# EAGLE schematic SparkFun_Qwiic_Audio_Amp (EAGLE 9.6.2)
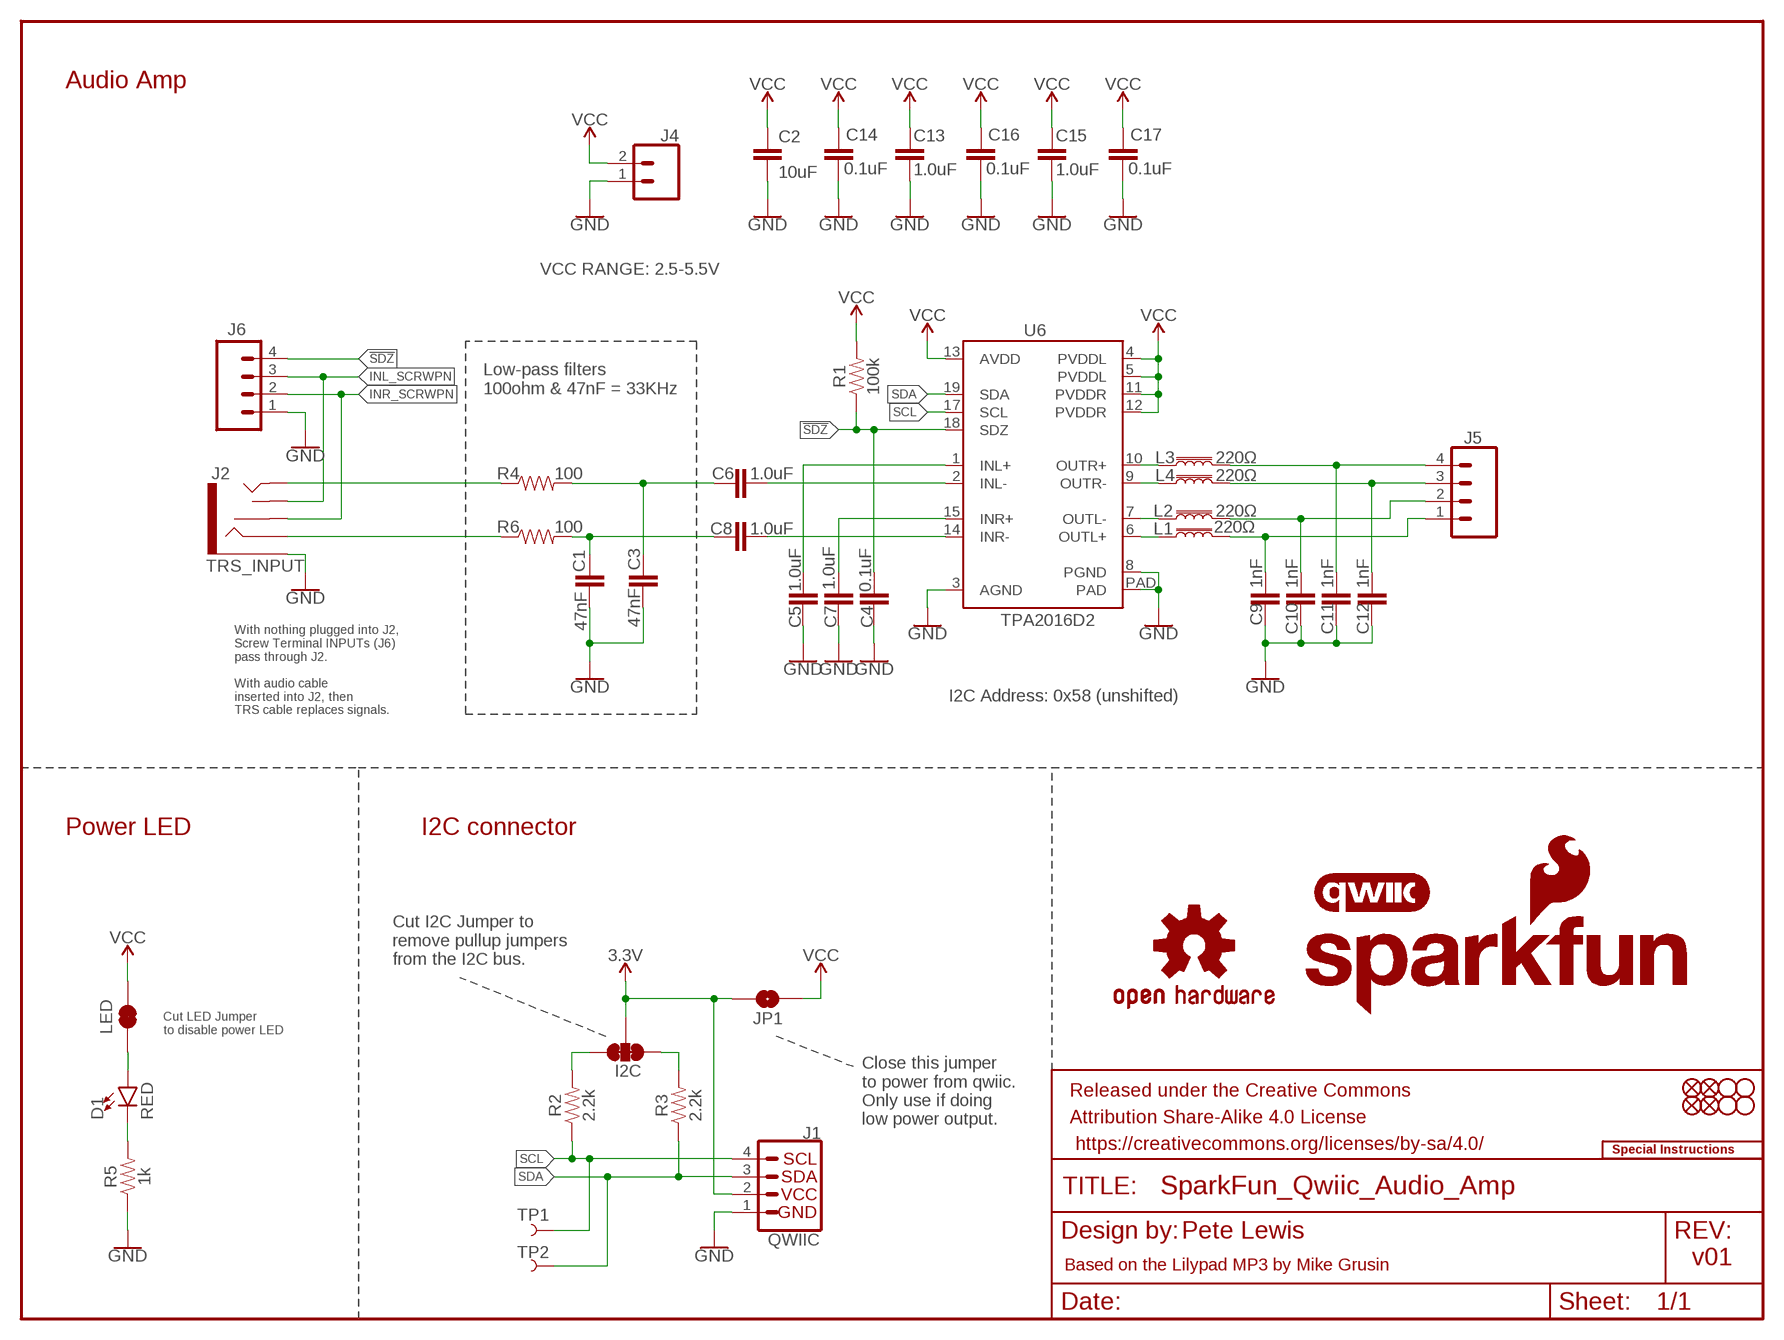
[diagram p0: schematic, sheet 1]

## Parts
C1  47nF  47NF-0402_TIGHT-25V-10%-X7R  [0402-TIGHT]
C2  10uF  10UF-0805-25V-10%  [0805]
C3  47nF  47NF-0402_TIGHT-25V-10%-X7R  [0402-TIGHT]
C4  0.1uF  0.1UF-0402T-16V-10%-X7R-WE  [0402-TIGHT]
C5  1.0uF  1.0UF-0402T-16V-10%  [0402-TIGHT]
C6  1.0uF  1.0UF-0402T-16V-10%  [0402-TIGHT]
C7  1.0uF  1.0UF-0402T-16V-10%  [0402-TIGHT]
C8  1.0uF  1.0UF-0402T-16V-10%  [0402-TIGHT]
C9  1nF  1.0NF/1000PF-0402-25V-10%-X7R  [0402]
C10  1nF  1.0NF/1000PF-0402-25V-10%-X7R  [0402]
C11  1nF  1.0NF/1000PF-0402-25V-10%-X7R  [0402]
C12  1nF  1.0NF/1000PF-0402-25V-10%-X7R  [0402]
C13  1.0uF  1.0UF-0402T-16V-10%  [0402-TIGHT]
C14  0.1uF  0.1UF-0402T-16V-10%-X7R-WE  [0402-TIGHT]
C15  1.0uF  1.0UF-0402T-16V-10%  [0402-TIGHT]
C16  0.1uF  0.1UF-0402T-16V-10%-X7R-WE  [0402-TIGHT]
C17  0.1uF  0.1UF-0402T-16V-10%-X7R-WE  [0402-TIGHT]
D1  RED  LED-RED0603  [LED-0603]
FD1  FIDUCIAL1X2  [FIDUCIAL-1X2]
FD2  FIDUCIAL1X2  [FIDUCIAL-1X2]
FD3  FIDUCIAL1X2  [FIDUCIAL-1X2]
FD4  FIDUCIAL1X2  [FIDUCIAL-1X2]
FRAME2  FRAME-LETTER  [CREATIVE_COMMONS]
H1  STAND-OFFTIGHT  [STAND-OFF-TIGHT]
H2  STAND-OFFTIGHT  [STAND-OFF-TIGHT]
H3  STAND-OFFTIGHT  [STAND-OFF-TIGHT]
H4  STAND-OFFTIGHT  [STAND-OFF-TIGHT]
I2C  JUMPER-SMT_3_2-NC_TRACE_SILK  [SMT-JUMPER_3_2-NC_TRACE_SILK]
J1  QWIIC  QWIIC_CONNECTORJS-1MM  [JST04_1MM_RA]
J2  TRS_INPUT  AUDIO_JACK_3.5MM_SMD  [AUDIO-JACK-3.5MM-SMD]
J4  CONN_023.5MM  [SCREWTERMINAL-3.5MM-2]
J5  CONN_04SCREW  [SCREWTERMINAL-3.5MM-4]
J6  SCREW  CONN_04SCREW  [SCREWTERMINAL-3.5MM-4]
JP1  JP1  JUMPER-SMT_2_NO_SILK  [SMT-JUMPER_2_NO_SILK]
L1  220Ω  FERRITE_BEAD-0805-220Ω-100MHZ-2A  [0805]
L2  220Ω  FERRITE_BEAD-0805-220Ω-100MHZ-2A  [0805]
L3  220Ω  FERRITE_BEAD-0805-220Ω-100MHZ-2A  [0805]
L4  220Ω  FERRITE_BEAD-0805-220Ω-100MHZ-2A  [0805]
LED  JUMPER-SMT_2_NC_TRACE_SILK  [SMT-JUMPER_2_NC_TRACE_SILK]
LOGO2  SFE_LOGO_NAME_FLAME.1_INCH  [SFE_LOGO_NAME_FLAME_.1]
LOGO3  QWIIC_LOGO_4MM  [QWIIC_4MM]
LOGO4  OSHW-LOGOS  [OSHW-LOGO-S]
LOGO5  SFE_LOGO_FLAME.1_INCH  [SFE_LOGO_FLAME_.1]
LOGO6  SPECIAL_INSTRUCTIONS-ORDERING  [ORDERING_INSTRUCTIONS]
R1  100k  100KOHM-0402T-1/16W-1%  [0402-TIGHT]
R2  2.2k  2.2KOHM-0402T-1/16W-1%  [0402-TIGHT]
R3  2.2k  2.2KOHM-0402T-1/16W-1%  [0402-TIGHT]
R4  100  100OHM-0402-TIGHT-1/16W-1%  [0402-TIGHT]
R5  1k  1KOHM-0402T-1/16W-1%  [0402-TIGHT]
R6  100  100OHM-0402-TIGHT-1/16W-1%  [0402-TIGHT]
TP1  TEST-POINTTP_15TH_THRU  [TP_15TH]
TP2  TEST-POINTTP_15TH_THRU  [TP_15TH]
U6  TPA2016D2  TPA2016D2RTJ  [QFN-20-0.5MM]

## Nets
3.3V: I2C.2 J1.2 JP1.1
!SDZ!: C4.1 J6.4 R1.1 U6.18(SDZ)
GND: C1.2 C2.2 C3.2 C4.2 C5.1 C7.1 C9.2 C10.2 C11.2 C12.2 C13.2 C14.2 C15.2 C16.2 C17.2 J1.1 J2.SLEEVE J4.1 J6.1 R5.1 U6.3(AGND) U6.8(PGND) U6.PAD
INL: J2.TIP R4.1
INL_SCRWPN: J2.TSH J6.3
INR: J2.RING R6.1
INR_SCRWPN: J2.RSH J6.2
N$1: L1.1 U6.6(OUTL+)
N$2: L2.1 U6.7(OUTL-)
N$3: C1.1 C8.1 R6.2
N$4: D1.C R5.2
N$5: C3.1 C6.1 R4.2
N$6: D1.A LED.1
N$16: I2C.3 R2.2
N$17: I2C.1 R3.2
N$18: L3.1 U6.10(OUTR+)
N$19: L4.1 U6.9(OUTR-)
N$20: C8.2 U6.14(INR-)
N$21: C5.2 U6.1(INL+)
N$22: C6.2 U6.2(INL-)
N$25: C7.2 U6.15(INR+)
SCL: J1.4 R2.1 TP1.1 U6.17(SCL)
SDA: J1.3 R3.1 TP2.1 U6.19(SDA)
SPK_L_+: C9.1 J5.1 L1.2
SPK_L_-: C10.1 J5.2 L2.2
SPK_R_+: C11.1 J5.4 L3.2
SPK_R_-: C12.1 J5.3 L4.2
VCC: C2.1 C13.1 C14.1 C15.1 C16.1 C17.1 J4.2 JP1.2 LED.2 R1.2 U6.4(PVDDL) U6.5(PVDDL) U6.11(PVDDR) U6.12(PVDDR) U6.13(AVDD)

## Notes on the sheet
- Audio Amp
- VCC RANGE: 2.5-5.5V
- Low-pass filters
  100ohm & 47nF = 33KHz
- I2C Address: 0x58 (unshifted)
- With nothing plugged into J2,
  Screw Terminal INPUTs (J6)
  pass through J2.
  
  With audio cable
  inserted into J2, then
  TRS cable replaces signals.
- Power LED | I2C connector
- Cut I2C Jumper to 
  remove pullup jumpers 
  from the I2C bus.
- Cut LED Jumper
  to disable power LED
- Close this jumper
  to power from qwiic.
  Only use if doing
  low power output.
- Pete Lewis
- v01
- Based on the Lilypad MP3 by Mike Grusin

## Library data of the parts
C1 C3 = SparkFun-Capacitors:47NF: 47nF ceramic capacitors A capacitor is a passive two-terminal electrical component used to store electrical energy temporarily in an electric field.; PROD_ID: CAP-14243
C2 = SparkFun-Capacitors:10UF: 10.0µF ceramic capacitors A capacitor is a passive two-terminal electrical component used to store electrical energy temporarily in an electric field.; PROD_ID: CAP-14259
C4 C14 C16 C17 = SparkFun-Capacitors:0.1UF: 0.1µF ceramic capacitors A capacitor is a passive two-terminal electrical component used to store electrical energy temporarily in an electric field.; PROD_ID: CAP-16507
C5-C8 C13 C15 = SparkFun-Capacitors:1.0UF: 1µF ceramic capacitors A capacitor is a passive two-terminal electrical component used to store electrical energy temporarily in an electric field.; PROD_ID: CAP-12417
C9-C12 = SparkFun-Capacitors:1.0NF/1000PF: 1nF/1,000pF ceramic capacitors A capacitor is a passive two-terminal electrical component used to store electrical energy temporarily in an electric field.; PROD_ID: CAP-15061
D1 = SparkFun-LED:LED-RED: Red SMD LED Used in manufacturing of most products at SparkFun Packages: 0603 - SMD 0603 package [Product Link] <http://docs.avagotech.com/docs/AV02-0551EN> 0603 SMART - SMD 0603 SMART package ( more efficient and expensive)[Product Link] <http://www.osram-os.com/Graphics/XPic2/00077099_0.pdf> 1206 - SMD1206 package [Product Link] <https://www.sparkfun.com/datasheets/DevTools/LilyPad/Q150OVS4.pdff> SparkFun Products: Pro Mini 328 -5V <https://www.sparkfun.com/products/821> RedBoard <https://www.sparkfun.com/products/12757> IOIO-OTG <https://www.sparkfun.com/products/13613>; PROD_ID: DIO-00819
FD1-FD4 = SparkFun-Aesthetics:FIDUCIAL: Fiducial Alignment Points Point-of-reference for pick-and-place machines and other optical instruments.
FRAME2 = SparkFun-Aesthetics:FRAME-LETTER: Schematic Frame - Letter Standard 8.5x11 US Letter frame
H1-H4 = SparkFun-Hardware:STAND-OFF: Stand Off Drill holes for mechanically mounting via screws, standoffs, etc. Note: Use the keepout ring to avoid running the screw head into surrounding components. Variant Overviews STAND-OFF - Mechanical footprint for a #4 phillips button head screw. STAND-OFF-TIGHT - Mechanical footprint for a #4 phillips button head screw, Example SparkFun Products Screw - Phillips Head (1/4", 4-40, 10 pack) <https://www.sparkfun.com/products/10453> (PRT-10453) Screw - Phillips Head (1/2", 4-40, 10 pack) <https://www.sparkfun.com/products/10452> (PRT-10452) Screw - Phillips Head (3/4", 4-40, 10 pack) <https://www.sparkfun.com/products/10451> (PRT-10451) Screw - Phillips Head (1", 4-40, 10 pack) <https://www.sparkfun.com/products/10450> (PRT-10450)
I2C = SparkFun-Jumpers:JUMPER-SMT_3_2-NC_TRACE: Normally closed trace jumper (2 of 2 connections) This jumper has a trace between all three pads so they are normally closed (NC). Use a razor knife to open the connection(s). For best results follow the IPC guidelines for cutting traces: Cutout at least 0.063 mm (0.005 in). Remove all loose material to clean up the cut area. Seal the cut with an approved epoxy. Reapply solder to reclose the connection(s).
J1 = SparkFun-Connectors:QWIIC_CONNECTOR: SparkFun I2C Standard Qwiic Connector An SMD 1mm pitch JST connector makes it easy and quick (get it? Qwiic?) to connect I2C devices to each other. The Qwiic system <http://www.sparkfun.com/qwiic> enables fast and solderless connection between popular platforms and various sensors and actuators. We carry 200mm <https://www.sparkfun.com/products/14204>, 100mm <https://www.sparkfun.com/products/14205>, 50mm <https://www.sparkfun.com/products/14206>, and breadboard friendly <https://www.sparkfun.com/products/14207> Qwiic cables. We also offer 10 pcs strips <https://www.sparkfun.com/products/14323> the SMD connectors.; PROD_ID: CONN-13694; VALUE: QWIIC_RIGHT_ANGLE
J2 = SparkFun-Connectors:AUDIO_JACK_3.5MM: Audio Jack 3.5mm variants of PTH and SMT stereo audio jack with bypass switches. SparkFun Products: SparkFun SparkPunk Sound Kit <[https://www.sparkfun.com/products/11177]> - PTH MP3 Trigger <https://www.sparkfun.com/products/13720> -3.5mm SMD SparkFun PicoBoard <https://www.sparkfun.com/products/11888>- 2.5mm SMD; PROD_ID: CONN-10353
J4 = SparkFun-Connectors:CONN_02: Multi connection point. Often used as Generic Header-pin footprint for 0.1 inch spaced/style header connections On any of the 0.1 inch spaced packages, you can populate with these: Break Away Headers - Straight <https://www.sparkfun.com/products/116> (PRT-00116) Break Away Male Headers - Right Angle <https://www.sparkfun.com/products/553> (PRT-00553) Female Headers <https://www.sparkfun.com/products/115> (PRT-00115) Break Away Headers - Machine Pin <https://www.sparkfun.com/products/117> (PRT-00117) Break Away Female Headers - Swiss Machine Pin <https://www.sparkfun.com/products/743> (PRT-00743) For SCREWTERMINALS and SPRING TERMINALS visit here: Screw Terimnals on SparkFun.com <https://www.sparkfun.com/search/results?term=Screw+Terminals> (5mm/3.5mm/2.54mm spacing) This device is also useful as a general connection point to wire up your design to another part of your project. Our various solder wires solder well into these plated through hole pads. Hook-Up Wire - Assortment (Stranded, 22 AWG) <https://www.sparkfun.com/products/11375> (PRT-11375) Hook-Up Wire - Assortment (Solid Core, 22 AWG) <https://www.sparkfun.com/products/11367> (PRT-11367) View the entire wire category on our website here <https://www.sparkfun.com/categories/141> Special notes: Molex polarized connector foot print use with: PRT-08233 with associated crimp pins and housings. 2.54_SCREWTERM for use with PRT-10571. 3.5mm Screw Terminal footprints for PRT-08084 5mm Screw Terminal footprints for use with PRT-08432; PROD_ID: CONN-08399
J5 J6 = SparkFun-Connectors:CONN_04: Multi connection point. Often used as Generic Header-pin footprint for 0.1 inch spaced/style header connections On any of the 0.1 inch spaced packages, you can populate with these: Break Away Headers - Straight <https://www.sparkfun.com/products/116> (PRT-00116) Break Away Male Headers - Right Angle <https://www.sparkfun.com/products/553> (PRT-00553) Female Headers <https://www.sparkfun.com/products/115> (PRT-00115) Break Away Headers - Machine Pin <https://www.sparkfun.com/products/117> (PRT-00117) Break Away Female Headers - Swiss Machine Pin <https://www.sparkfun.com/products/743> (PRT-00743) For SCREWTERMINALS and SPRING TERMINALS visit here: Screw Terimnals on SparkFun.com <https://www.sparkfun.com/search/results?term=Screw+Terminals> (5mm/3.5mm/2.54mm spacing) This device is also useful as a general connection point to wire up your design to another part of your project. Our various solder wires solder well into these plated through hole pads. Hook-Up Wire - Assortment (Stranded, 22 AWG) <https://www.sparkfun.com/products/11375> (PRT-11375) Hook-Up Wire - Assortment (Solid Core, 22 AWG) <https://www.sparkfun.com/products/11367> (PRT-11367) View the entire wire category on our website here <https://www.sparkfun.com/categories/141> Special notes: Molex polarized connector foot print use with SKU : PRT-08231 with associated crimp pins and housings. 1MM SMD Version SKU: PRT-10208; PROD_ID: CONN-14485
JP1 = SparkFun-Jumpers:JUMPER-SMT_2_NO: Normally open jumper This jumper has two pads in close proximity to each other. Apply solder to close the connection. Round pads are easier to solder for beginners, but are a lot larger. SparkFun Product that uses the round pads: SparkFun EL Sequencer <https://www.sparkfun.com/products/12781>
L1-L4 = SparkFun-Coils:FERRITE_BEAD: Ferrite Bead (blocks, cores, rings, chokes, etc.) Inductor with layers of ferrite used to suppress high frequencies. Often used to isolate high frequency noise. SparkFun Products: IOIO-OTG - V2.2 <https://www.sparkfun.com/products/13613> SparkFun SAMD21 Mini Breakout <https://www.sparkfun.com/products/13664> SparkFun 6 Degrees of Freedom Breakout - LSM6DS3 <https://www.sparkfun.com/products/13339> SparkFun SAMD21 Dev Breakout <https://www.sparkfun.com/products/13672> Lilypad MP3 <https://www.sparkfun.com/products/11013>; PROD_ID: NDUC-10201
LED = SparkFun-Jumpers:JUMPER-SMT_2_NC_TRACE: Normally closed trace jumper This jumper has a trace between two pads so it's normally closed (NC). Use a razor knife to open the connection. For best results follow the IPC guidelines for cutting traces: Cutout at least 0.063 mm (0.005 in). Remove all loose material to clean up the cut area. Seal the cut with an approved epoxy. Reapply solder to reclose the connection.
LOGO2 = SparkFun-Aesthetics:SFE_LOGO_NAME_FLAME: SparkFun Font Logo w/ Flame This is the SparkFun full logo. The logo on the schematic will always be the same size; the package variant is the height of the flame part of the logo. Default layer for the logo on the board is tSilk.
LOGO3 = SparkFun-Aesthetics:QWIIC_LOGO: Qwiic Logos for placement on schematic and PCB. The 5.5mm silk logo is best for placing next to Qwiic connector.
LOGO4 = SparkFun-Aesthetics:OSHW-LOGO: Open-Source Hardware (OSHW) Logo This logo indicates the piece of hardware it is found on incorporates a OSHW license and/or adheres to the definition of open source hardware found here: http://freedomdefined.org/OSHW
LOGO5 = SparkFun-Aesthetics:SFE_LOGO_FLAME: SparkFun Flame Logo This is the SparkFun flame logo. The logo on the schematic will always be the same size; the package variant is the height of the flame. Default layer for the logo on the board is tSilk.
LOGO6 = SparkFun-Aesthetics:SPECIAL_INSTRUCTIONS: Special Ordering/Production Instructions Alert Symbol for special PCB ordering instructions or unique production process warnings. Ordering Instructions Production Instructions Types of information that should be added to box: Copper weight Soldermask color Silk color PCB thickness Number of layers PCB Standard: 1.6mm FR4 1 oz copper immersion silver plating red soldermask white silkscreen Types of information that should be added to box: Special wash requirements Depaneling instructions Humidification Glue curing Default text settings: 0.07 inch 9% ratio 50% line distance; PROD_ID: PCB-17002
R1 = SparkFun-Resistors:100KOHM: 100kΩ resistor A resistor is a passive two-terminal electrical component that implements electrical resistance as a circuit element. Resistors act to reduce current flow, and, at the same time, act to lower voltage levels within circuits. - Wikipedia; PROD_ID: RES-13495
R2 R3 = SparkFun-Resistors:2.2KOHM: 2.2kΩ resistor A resistor is a passive two-terminal electrical component that implements electrical resistance as a circuit element. Resistors act to reduce current flow, and, at the same time, act to lower voltage levels within circuits. - Wikipedia; PROD_ID: RES-14341
R4 R6 = SparkFun-Resistors:100OHM: 100Ω resistor A resistor is a passive two-terminal electrical component that implements electrical resistance as a circuit element. Resistors act to reduce current flow, and, at the same time, act to lower voltage levels within circuits. - Wikipedia; PROD_ID: RES-14962
R5 = SparkFun-Resistors:1KOHM: 1kΩ resistor A resistor is a passive two-terminal electrical component that implements electrical resistance as a circuit element. Resistors act to reduce current flow, and, at the same time, act to lower voltage levels within circuits. - Wikipedia; PROD_ID: RES-14342
TP1 TP2 = SparkFun-Connectors:TEST-POINT: SparkFun Test Points Bare copper test points for troubleshooting or In-Circuit-Testing. These are used by our Production team for verifying production board runs using pogo-pins on test beds. SparkFun Products: SparkFun LSM9DS1 Breakout <https://www.sparkfun.com/products/13284> SparkFun PSOC <https://www.sparkfun.com/products/13714> SparkFun Load Cell Amplifier <https://www.sparkfun.com/products/13879>
U6 = temp:TPA2016D2: 2.8-W/Ch Stereo Class-D Audio Amplifier with I2C volume control, DRC and AGC The TPA2016D2 is a stereo, filter-free Class-D audio power amplifier with volume control, dynamic range compression (DRC) and automatic gain control (AGC). It is available in a 2.2 mm x 2.2 mm WCSP package and 20-pin QFN package. The DRC/AGC function in the TPA2016D2 is programmable via a digital I2C interface. The DRC/AGC function can be configured to automatically prevent distortion of the audio signal and enhance quiet passages that are normally not heard. The DRC/AGC can also be configured to protect the speaker from damage at high power levels and compress the dynamic range of music to fit within the dynamic range of the speaker. The gain can be selected from ?28 dB to +30 dB in 1-dB steps. The TPA2016D2 is capable of driving 1.7 W/Ch at 5 V or750 mW/Ch at 3.6 V into 8 ? load or 2.8 W/Ch at 5 V or 1.5 W/Ch at 3.6 V into 4 ? load. The device features independent software shutdown controls for each channel and also provides thermal and short circuit protection. In addition to these features, a fast start-up time and small package size make the TPA2016D2 an ideal choice for cellular handsets, PDAs and other portable applications. · 1.7 W/Ch Into 8 ? at 5 V (10% THD+N) · 750 mW/Ch Into 8 ? at 3.6 V (10% THD+N) · 2.8 W/Ch Into 4 ? at 5 V (10% THD+N) · 1.5 W/Ch Into 4 ? at 3.6 V (10% THD+N) · Power Supply Range: 2.5 V to 5.5 V · Flexible Operation With/Without I2C · Programmable DRC/AGC Parameters · Digital I2C Volume Control · Selectable Gain from ?28 dB to 30 dB in 1-dB Steps (when compression is used) · Selectable Attack, Release and Hold Times · 4 Selectable Compression Ratios · Low Supply Current: 3.5 mA · Low Shutdown Current: 0.2 mA · High PSRR: 80 dB · Fast Start-up Time: 5 ms circuit protection. · AGC Enable/Disable Function · Limiter Enable/Disable Function · Short-Circuit and Thermal Protection; PROD_ID: IC-11061

## Net classes
1 VCC: width 0.254 mm, clearance 0.254 mm